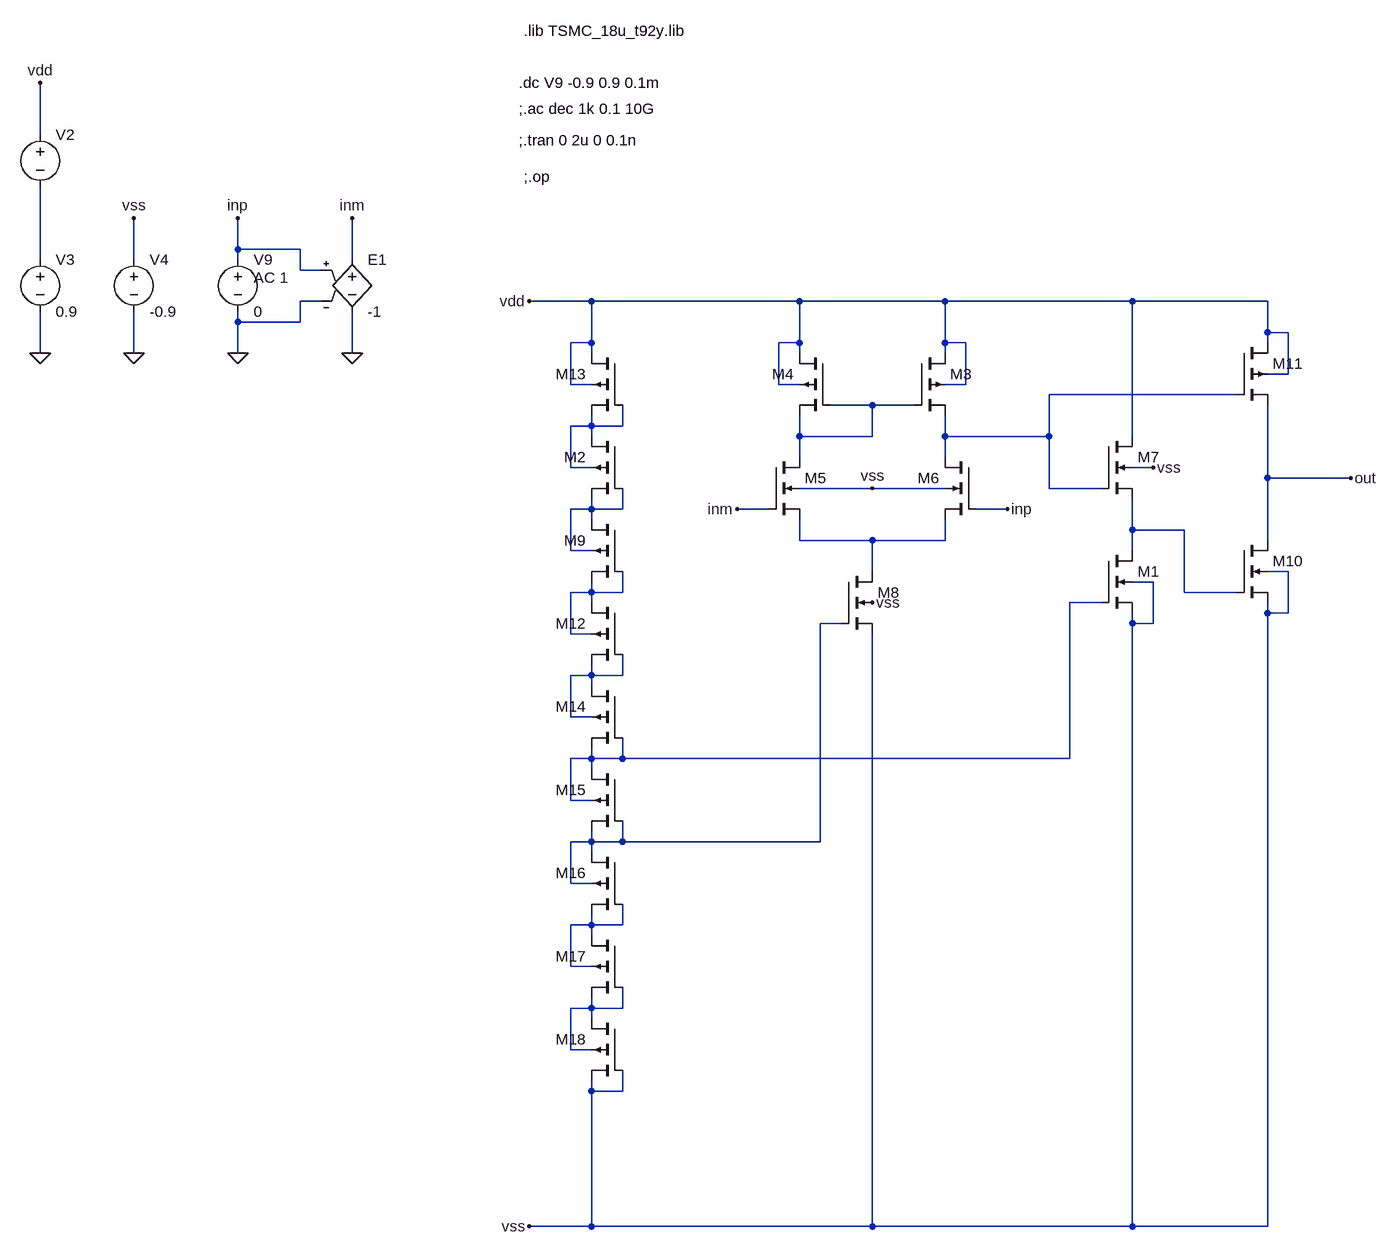
[diagram p0: schematic Draft2.asc]
Draft2.asc, the LTspice schematic file:
Version 4
SHEET 1 4108 2052
WIRE 224 -160 224 -240
WIRE 528 16 528 -32
WIRE 624 16 528 16
WIRE 224 32 224 -80
WIRE 368 32 368 -32
WIRE 528 32 528 16
WIRE 704 32 704 -32
WIRE 624 48 624 16
WIRE 656 48 624 48
WIRE 656 96 624 96
WIRE 1072 96 976 96
WIRE 1392 96 1072 96
WIRE 1616 96 1392 96
WIRE 1904 96 1616 96
WIRE 2112 96 1904 96
WIRE 528 128 528 112
WIRE 624 128 624 96
WIRE 624 128 528 128
WIRE 2112 144 2112 96
WIRE 2144 144 2112 144
WIRE 1072 160 1072 96
WIRE 1072 160 1040 160
WIRE 1392 160 1392 96
WIRE 1392 160 1360 160
WIRE 1616 160 1616 96
WIRE 1648 160 1616 160
WIRE 2112 160 2112 144
WIRE 224 176 224 112
WIRE 368 176 368 112
WIRE 528 176 528 128
WIRE 704 176 704 112
WIRE 1072 176 1072 160
WIRE 1392 176 1392 160
WIRE 1616 176 1616 160
WIRE 2144 208 2144 144
WIRE 2144 208 2112 208
WIRE 1040 224 1040 160
WIRE 1072 224 1040 224
WIRE 1360 224 1360 160
WIRE 1392 224 1360 224
WIRE 1648 224 1648 160
WIRE 1648 224 1616 224
WIRE 2064 240 1776 240
WIRE 1504 256 1440 256
WIRE 1568 256 1504 256
WIRE 1072 288 1072 272
WIRE 1072 288 1040 288
WIRE 1120 288 1120 256
WIRE 1120 288 1072 288
WIRE 1072 304 1072 288
WIRE 1392 304 1392 272
WIRE 1504 304 1504 256
WIRE 1504 304 1392 304
WIRE 1616 304 1616 272
WIRE 1776 304 1776 240
WIRE 1776 304 1616 304
WIRE 1904 304 1904 96
WIRE 1392 336 1392 304
WIRE 1616 336 1616 304
WIRE 1040 352 1040 288
WIRE 1072 352 1040 352
WIRE 1936 352 1904 352
WIRE 2112 368 2112 256
WIRE 2240 368 2112 368
WIRE 1504 384 1392 384
WIRE 1616 384 1504 384
WIRE 1776 384 1776 304
WIRE 1856 384 1776 384
WIRE 1072 416 1072 400
WIRE 1072 416 1040 416
WIRE 1120 416 1120 384
WIRE 1120 416 1072 416
WIRE 1344 416 1296 416
WIRE 1712 416 1664 416
WIRE 1072 432 1072 416
WIRE 1904 448 1904 400
WIRE 1984 448 1904 448
WIRE 1392 464 1392 432
WIRE 1504 464 1392 464
WIRE 1616 464 1616 432
WIRE 1616 464 1504 464
WIRE 2112 464 2112 368
WIRE 1040 480 1040 416
WIRE 1072 480 1040 480
WIRE 1904 480 1904 448
WIRE 1504 512 1504 464
WIRE 2144 512 2112 512
WIRE 1936 528 1904 528
WIRE 1072 544 1072 528
WIRE 1072 544 1040 544
WIRE 1120 544 1120 512
WIRE 1120 544 1072 544
WIRE 1984 544 1984 448
WIRE 2064 544 1984 544
WIRE 1072 560 1072 544
WIRE 1856 560 1808 560
WIRE 2112 576 2112 560
WIRE 2144 576 2144 512
WIRE 2144 576 2112 576
WIRE 1456 592 1424 592
WIRE 1904 592 1904 576
WIRE 1936 592 1936 528
WIRE 1936 592 1904 592
WIRE 1040 608 1040 544
WIRE 1072 608 1040 608
WIRE 1072 672 1072 656
WIRE 1072 672 1040 672
WIRE 1120 672 1120 640
WIRE 1120 672 1072 672
WIRE 1072 688 1072 672
WIRE 1040 736 1040 672
WIRE 1072 736 1040 736
WIRE 1072 800 1072 784
WIRE 1072 800 1040 800
WIRE 1120 800 1120 768
WIRE 1120 800 1072 800
WIRE 1808 800 1808 560
WIRE 1808 800 1120 800
WIRE 1072 816 1072 800
WIRE 1040 864 1040 800
WIRE 1072 864 1040 864
WIRE 1072 928 1072 912
WIRE 1072 928 1040 928
WIRE 1120 928 1120 896
WIRE 1120 928 1072 928
WIRE 1424 928 1424 592
WIRE 1424 928 1120 928
WIRE 1072 944 1072 928
WIRE 1040 992 1040 928
WIRE 1072 992 1040 992
WIRE 1072 1056 1072 1040
WIRE 1072 1056 1040 1056
WIRE 1120 1056 1120 1024
WIRE 1120 1056 1072 1056
WIRE 1072 1072 1072 1056
WIRE 1040 1120 1040 1056
WIRE 1072 1120 1040 1120
WIRE 1072 1184 1072 1168
WIRE 1072 1184 1040 1184
WIRE 1120 1184 1120 1152
WIRE 1120 1184 1072 1184
WIRE 1072 1200 1072 1184
WIRE 1040 1248 1040 1184
WIRE 1072 1248 1040 1248
WIRE 1072 1312 1072 1296
WIRE 1120 1312 1120 1280
WIRE 1120 1312 1072 1312
WIRE 1072 1520 1072 1312
WIRE 1072 1520 976 1520
WIRE 1504 1520 1504 608
WIRE 1504 1520 1072 1520
WIRE 1904 1520 1904 592
WIRE 1904 1520 1504 1520
WIRE 2112 1520 2112 576
WIRE 2112 1520 1904 1520
FLAG 224 176 0
FLAG 368 176 0
FLAG 224 -240 vdd
FLAG 368 -32 vss
FLAG 976 96 vdd
FLAG 1504 560 vss
FLAG 976 1520 vss
FLAG 528 176 0
FLAG 704 176 0
FLAG 528 -32 inp
FLAG 704 -32 inm
FLAG 2240 368 out
FLAG 1296 416 inm
FLAG 1712 416 inp
FLAG 1504 384 vss
FLAG 1936 352 vss
DATAFLAG 1488 304 ""
DATAFLAG 1792 240 ""
DATAFLAG 1504 464 ""
DATAFLAG 1904 448 ""
DATAFLAG 2176 368 ""
SYMBOL voltage 224 16 R0
WINDOW 123 0 0 Left 0
WINDOW 39 0 0 Left 0
SYMATTR InstName V3
SYMATTR Value 0.9
SYMBOL voltage 368 16 R0
WINDOW 123 0 0 Left 0
WINDOW 39 0 0 Left 0
SYMATTR InstName V4
SYMATTR Value -0.9
SYMBOL voltage 528 16 R0
WINDOW 123 24 44 Left 2
WINDOW 39 0 0 Left 0
SYMATTR Value2 AC 1
SYMATTR InstName V9
SYMATTR Value 0
SYMBOL e 704 16 R0
SYMATTR InstName E1
SYMATTR Value -1
SYMBOL nmos4 1456 512 R0
WINDOW 3 56 72 Invisible 2
SYMATTR Value cmosn
SYMATTR InstName M8
SYMATTR Value2 l=9.8u w=1.35u
SYMBOL nmos4 1344 336 R0
WINDOW 3 56 72 Invisible 2
SYMATTR Value cmosn
SYMATTR InstName M5
SYMATTR Value2 l=9u w=1.5u
SYMBOL nmos4 1856 304 R0
WINDOW 3 56 72 Invisible 2
SYMATTR Value cmosn
SYMATTR InstName M7
SYMATTR Value2 l=10.8u w=1.08u
SYMBOL nmos4 2064 464 R0
WINDOW 3 56 72 Invisible 2
SYMATTR Value cmosn
SYMATTR InstName M10
SYMATTR Value2 l=0.72u w=2u
SYMBOL nmos4 1856 480 R0
WINDOW 3 56 72 Invisible 2
SYMATTR Value cmosn
SYMATTR InstName M1
SYMATTR Value2 l=10.8u w=1.08u
SYMBOL pmos4 2064 160 R0
WINDOW 3 56 72 Invisible 2
SYMATTR Value cmosp
SYMATTR InstName M11
SYMATTR Value2 l=0.72u w=6.6u
SYMBOL pmos4 1440 176 M0
WINDOW 3 56 72 Invisible 2
SYMATTR Value cmosp
SYMATTR InstName M4
SYMATTR Value2 l=1.2u w=1.35u
SYMBOL pmos4 1568 176 R0
WINDOW 3 56 72 Invisible 2
SYMATTR Value cmosp
SYMATTR InstName M3
SYMATTR Value2 l=1.2u w=1.35u
SYMBOL nmos4 1664 336 M0
WINDOW 3 56 72 Invisible 2
SYMATTR Value cmosn
SYMATTR InstName M6
SYMATTR Value2 l=9u w=1.5u
SYMBOL voltage 224 -176 R0
WINDOW 123 0 0 Left 0
WINDOW 39 0 0 Left 0
SYMATTR InstName V2
SYMATTR Value ""
SYMBOL pmos4 1120 176 M0
WINDOW 3 56 72 Invisible 2
SYMATTR Value cmosp
SYMATTR InstName M13
SYMATTR Value2 l=2.7u w=0.27u
SYMBOL pmos4 1120 304 M0
WINDOW 3 56 72 Invisible 2
SYMATTR Value cmosp
SYMATTR InstName M2
SYMATTR Value2 l=2.7u w=0.27u
SYMBOL pmos4 1120 432 M0
WINDOW 3 56 72 Invisible 2
SYMATTR Value cmosp
SYMATTR InstName M9
SYMATTR Value2 l=2.7u w=0.27u
SYMBOL pmos4 1120 560 M0
WINDOW 3 56 72 Invisible 2
SYMATTR Value cmosp
SYMATTR InstName M12
SYMATTR Value2 l=2.7u w=0.27u
SYMBOL pmos4 1120 688 M0
WINDOW 3 56 72 Invisible 2
SYMATTR Value cmosp
SYMATTR InstName M14
SYMATTR Value2 l=2.7u w=0.27u
SYMBOL pmos4 1120 816 M0
WINDOW 3 56 72 Invisible 2
SYMATTR Value cmosp
SYMATTR InstName M15
SYMATTR Value2 l=2.7u w=0.27u
SYMBOL pmos4 1120 944 M0
WINDOW 3 56 72 Invisible 2
SYMATTR Value cmosp
SYMATTR InstName M16
SYMATTR Value2 l=2.7u w=0.27u
SYMBOL pmos4 1120 1072 M0
WINDOW 3 56 72 Invisible 2
SYMATTR Value cmosp
SYMATTR InstName M17
SYMATTR Value2 l=2.7u w=0.27u
SYMBOL pmos4 1120 1200 M0
WINDOW 3 56 72 Invisible 2
SYMATTR Value cmosp
SYMATTR InstName M18
SYMATTR Value2 l=2.7u w=0.27u
TEXT 968 -320 Left 2 !.lib TSMC_18u_t92y.lib
TEXT 960 -240 Left 2 !.dc V9 -0.9 0.9 0.1m
TEXT 960 -200 Left 2 !;.ac dec 1k 0.1 10G
TEXT 960 -152 Left 2 !;.tran 0 2u 0 0.1n
TEXT 968 -96 Left 2 !;.op

The netlist it stands for:
* Draft2.asc
V3 N001 0 0.9
V4 vss 0 -0.9
V9 inp 0 0 AC 1
E1 inm 0 inp 0 -1
M8 N007 N010 vss vss cmosn l=9.8u w=1.35u
M5 N003 inm N007 vss cmosn l=9u w=1.5u
M7 vdd N002 N006 vss cmosn l=10.8u w=1.08u
M10 out N006 vss vss cmosn l=0.72u w=2u
M1 N006 N009 vss vss cmosn l=10.8u w=1.08u
M11 vdd N002 out vdd cmosp l=0.72u w=6.6u
M4 vdd N003 N003 vdd cmosp l=1.2u w=1.35u
M3 vdd N003 N002 vdd cmosp l=1.2u w=1.35u
M6 N002 inp N007 vss cmosn l=9u w=1.5u
V2 vdd N001
M13 vdd N004 N004 vdd cmosp l=2.7u w=0.27u
M2 N004 N005 N005 N004 cmosp l=2.7u w=0.27u
M9 N005 N008 N008 N005 cmosp l=2.7u w=0.27u
M12 N008 N011 N011 N008 cmosp l=2.7u w=0.27u
M14 N011 N009 N009 N011 cmosp l=2.7u w=0.27u
M15 N009 N010 N010 N009 cmosp l=2.7u w=0.27u
M16 N010 N012 N012 N010 cmosp l=2.7u w=0.27u
M17 N012 N013 N013 N012 cmosp l=2.7u w=0.27u
M18 N013 vss vss N013 cmosp l=2.7u w=0.27u
.model NMOS NMOS
.model PMOS PMOS
.lib standard.mos
.lib TSMC_18u_t92y.lib
.dc V9 -0.9 0.9 0.1m
;.ac dec 1k 0.1 10G
;.tran 0 2u 0 0.1n
;.op
.backanno
.end